# EAGLE design S3A6_Output_Signal;s_v1p00 (EAGLE 9.6.2)
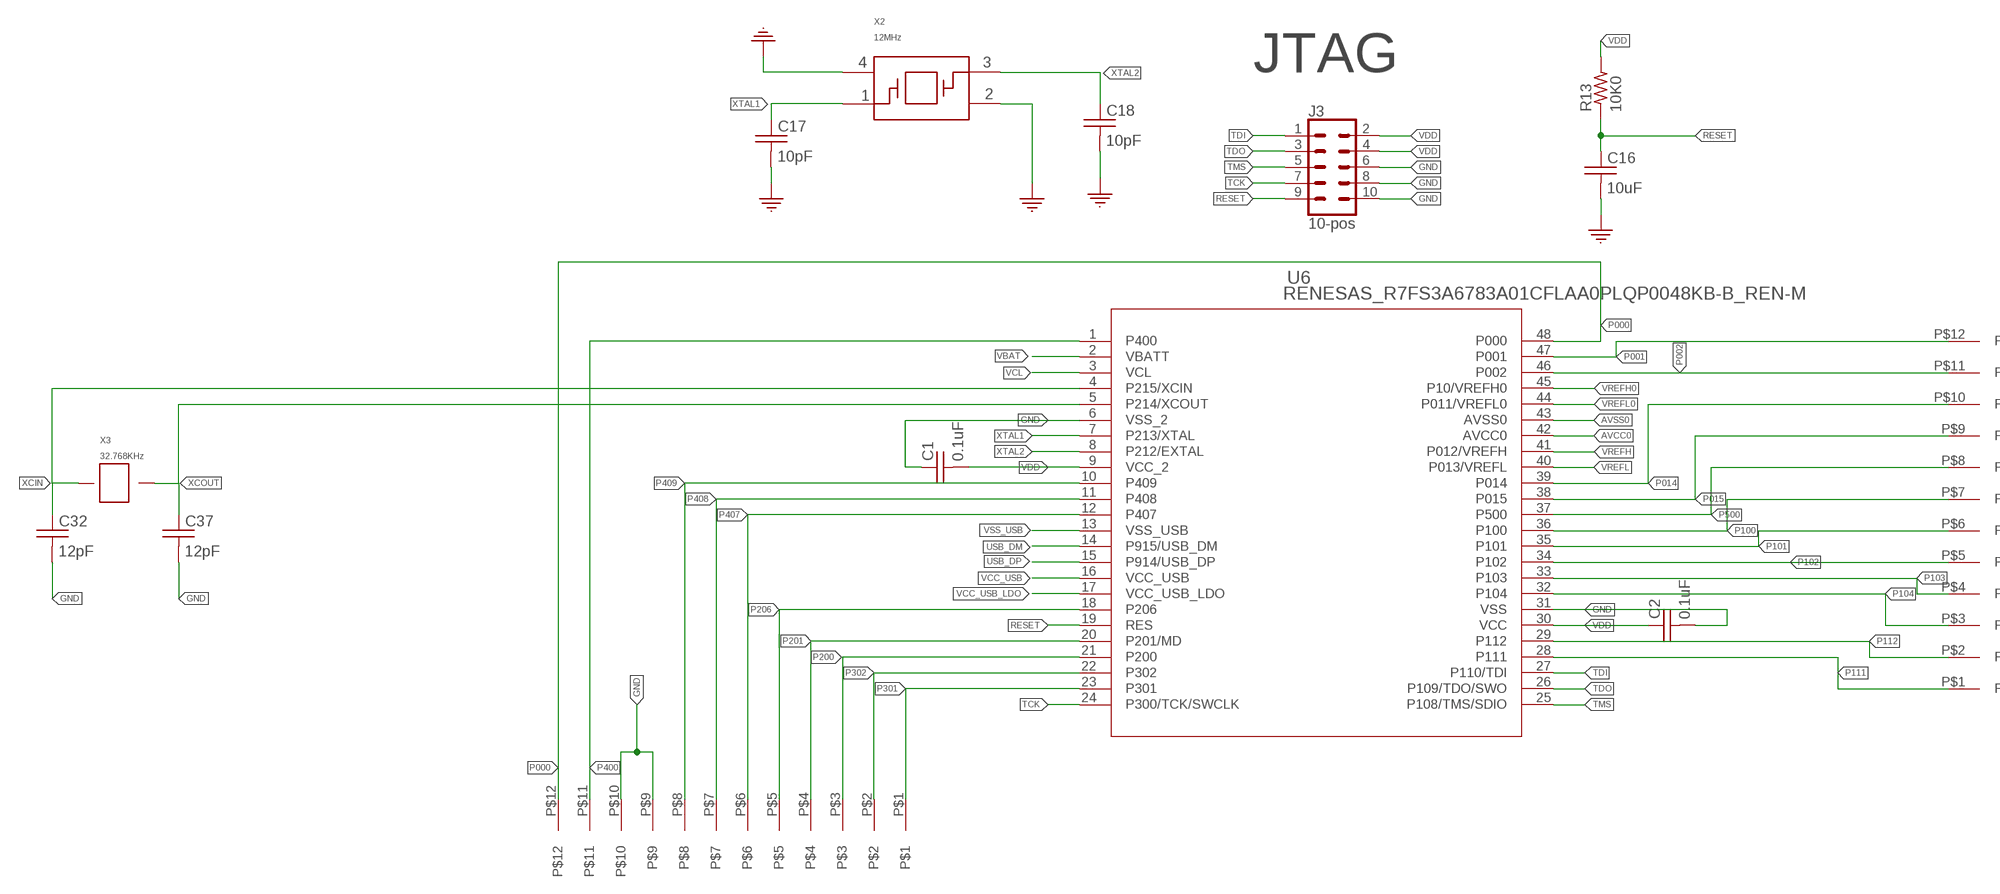
[diagram p0: schematic, sheet 1, part 1 of 2]
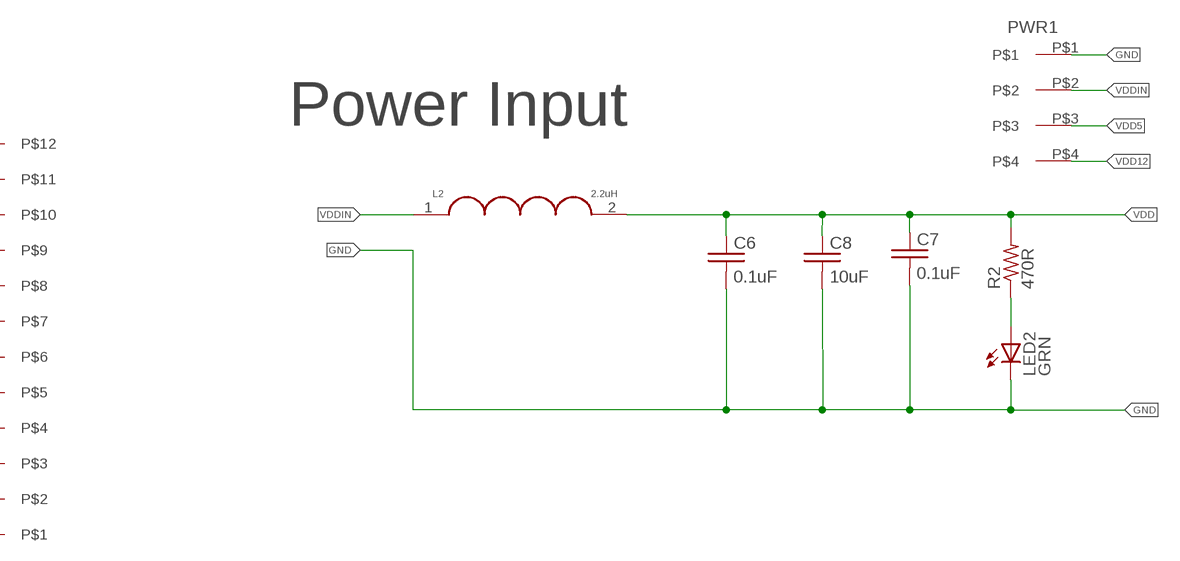
[diagram p1: schematic, sheet 1, part 2 of 2]

## Parts
C1  0.1uF  C_0402_0.1UF  [0402]
C2  0.1uF  C_0402_0.1UF  [0402]
C6  0.1uF  C_0402  [0402]
C7  0.1uF  C_0402  [0402]
C8  10uF  C_0402  [0402]
C16  10uF  C_0402_10UF  [0402]
C17  10pF  C_0402_18PF  [0402]
C18  10pF  C_0402_18PF  [0402]
C32  12pF  C_0402_12PF  [0402]
C37  12pF  C_0402_12PF  [0402]
J3  10-pos  CONN_05X2_RAPTH  [2X5]
L2  2.2uH  INDUCTOR_1008_2.2_MH_1.3A  [1008_(2520_METRIC)]
LED2  LED_0805_GREEN  [LED_0805_GREEN]
PWR1  4-pos  3.81MM_1_X_4_RT_ANGLE_PLUG_HEADER  [1X4_3.81MM_PITCH]
R2  470R  R_0402  [0402]
R13  10K0  R_0402_10K0  [0402]
U6  RENESAS_R7FS3A6783A01CFLAA0PLQP0048KB-B_REN-M  [PLQP0048KB-B_REN-M]
U$1  1_X_12_HEADER_GENERIC_.1INCH  [HEADER_1_X_12_.1_INCH]
U$2  1_X_12_HEADER_GENERIC_.1INCH  [HEADER_1_X_12_.1_INCH]
X2  12MHz  XTAL_24_MHZ  [SMD_3225]
X3  32.768KHz  XTAL_32.768KHZ  [SMD_X_2_PADS]

## Nets
AVCC0: U6.42(AVCC0)
AVSS0: U6.43(AVSS0)
GND: C1.P$1 C2.P$2 C6.P$2 C7.P$2 C8.P$2 C16.P$2 C17.P$2 C18.P$2 C32.P$2 C37.P$2 J3.6 J3.8 J3.10 LED2.C PWR1.P$1 U6.6(VSS_2) U6.31(VSS) U$1.P$9 U$1.P$10 X2.2 X2.4
N$2: LED2.A R2.P$1
P000: U6.48(P000) U$1.P$12
P001: U6.47(P001) U$2.P$12
P002: U6.46(P002) U$2.P$11
P014: U6.39(P014) U$2.P$10
P015: U6.38(P015) U$2.P$9
P100: U6.36(P100) U$2.P$7
P101: U6.35(P101) U$2.P$6
P102: U6.34(P102) U$2.P$5
P103: U6.33(P103) U$2.P$4
P104: U6.32(P104) U$2.P$3
P111: U6.28(P111) U$2.P$1
P112: U6.29(P112) U$2.P$2
P200: U6.21(P200) U$1.P$3
P201: U6.20(P201/MD) U$1.P$4
P206: U6.18(P206) U$1.P$5
P301: U6.23(P301) U$1.P$1
P302: U6.22(P302) U$1.P$2
P400: U6.1(P400) U$1.P$11
P407: U6.12(P407) U$1.P$6
P408: U6.11(P408) U$1.P$7
P409: U6.10(P409) U$1.P$8
P500: U6.37(P500) U$2.P$8
RESET: C16.P$1 J3.9 R13.P$1 U6.19(RES)
TCK: J3.7 U6.24(P300/TCK/SWCLK)
TDI: J3.1 U6.27(P110/TDI)
TDO: J3.3 U6.26(P109/TDO/SWO)
TMS: J3.5 U6.25(P108/TMS/SDIO)
USB_DM: U6.14(P915/USB_DM)
USB_DP: U6.15(P914/USB_DP)
VBAT: U6.2(VBATT)
VCC_USB: U6.16(VCC_USB)
VCC_USB_LDO: U6.17(VCC_USB_LDO)
VCL: U6.3(VCL)
VDD: C1.P$2 C2.P$1 C6.P$1 C7.P$1 C8.P$1 J3.2 J3.4 L2.2 R2.P$2 R13.P$2 U6.9(VCC_2) U6.30(VCC)
VDD5: PWR1.P$3
VDD12: PWR1.P$4
VDDIN: L2.1 PWR1.P$2
VREFH: U6.41(P012/VREFH)
VREFH0: U6.45(P10/VREFH0)
VREFL: U6.40(P013/VREFL)
VREFL0: U6.44(P011/VREFL0)
VSS_USB: U6.13(VSS_USB)
XCIN: C32.P$1 U6.4(P215/XCIN) X3.P$1
XCOUT: C37.P$1 U6.5(P214/XCOUT) X3.P$2
XTAL1: C17.P$1 U6.7(P213/XTAL) X2.1
XTAL2: C18.P$1 U6.8(P212/EXTAL) X2.3

## Notes on the sheet
- JTAG
- Power Input

## Library data of the parts
C1 C2 = 3D_MIG_Controller:C_0402_0.1UF; PARTNO: CL05F104ZO5NNNC
C6-C8 = 3D_MIG_Controller:C_0402
C16 = 3D_MIG_Controller:C_0402_10UF; PARTNO: CL05A106MP8NUB8
C17 C18 = 3D_MIG_Controller:C_0402_18PF; PARTNO: UMK105CG180JV-F; VALUE: 18pF
C32 C37 = 3D_MIG_Controller:C_0402_12PF; PARTNO: CL05C120JB5NNNC
J3 = 3D_MIG_Controller:CONN_05X2_RA: Connector Header Through Hole, Right Angle 10 position 0.100" (2.54mm); PARTNO: PH2RA-10-UA
L2 = 3D_MIG_Controller:INDUCTOR_1008_2.2_MH_1.3A
LED2 = 3D_MIG_Controller:LED_0805_GREEN
PWR1 = 3D_MIG_Controller:3.81MM_1_X_4_RT_ANGLE_PLUG_HEADER: 4 Position Terminal Block Header, Male Pins, Shrouded (4 Side) 0.150" (3.81mm) 90°, Right Angle - Through Hole; PARTNO: 691322310004
R2 = 3D_MIG_Controller:R_0402
R13 = 3D_MIG_Controller:R_0402_10K0; PARTNO: RMCF0402JT10K0
U6 = 3D_MIG_Controller:RENESAS_R7FS3A6783A01CFLAA0; BUILT_BY: EMA_Cory; COPYRIGHT: Copyright (C) 2021 Accelerated Designs. All rights reserved; DATASHEET: https://www.renesas.com/us/en/document/dst/s3a6-microcontroller-group-datasheet-r01ds0308eu0120?language=en; MANUFACTURER_PART_NUMBER: R7FS3A6783A01CFL#AA0; SOURCELIBRARY: Add_to_database_2021-06-10; VENDOR: Renesas Electronics
U$1 U$2 = 3D_MIG_Controller:1_X_12_HEADER_GENERIC_.1INCH
X2 = 3D_MIG_Controller:XTAL_24_MHZ; PARTNO: FA-238 24.0000MB-C3; VALUE: 24MHz
X3 = 3D_MIG_Controller:XTAL_32.768KHZ; PARTNO: ABS07-32.768KHZ-T

## Board
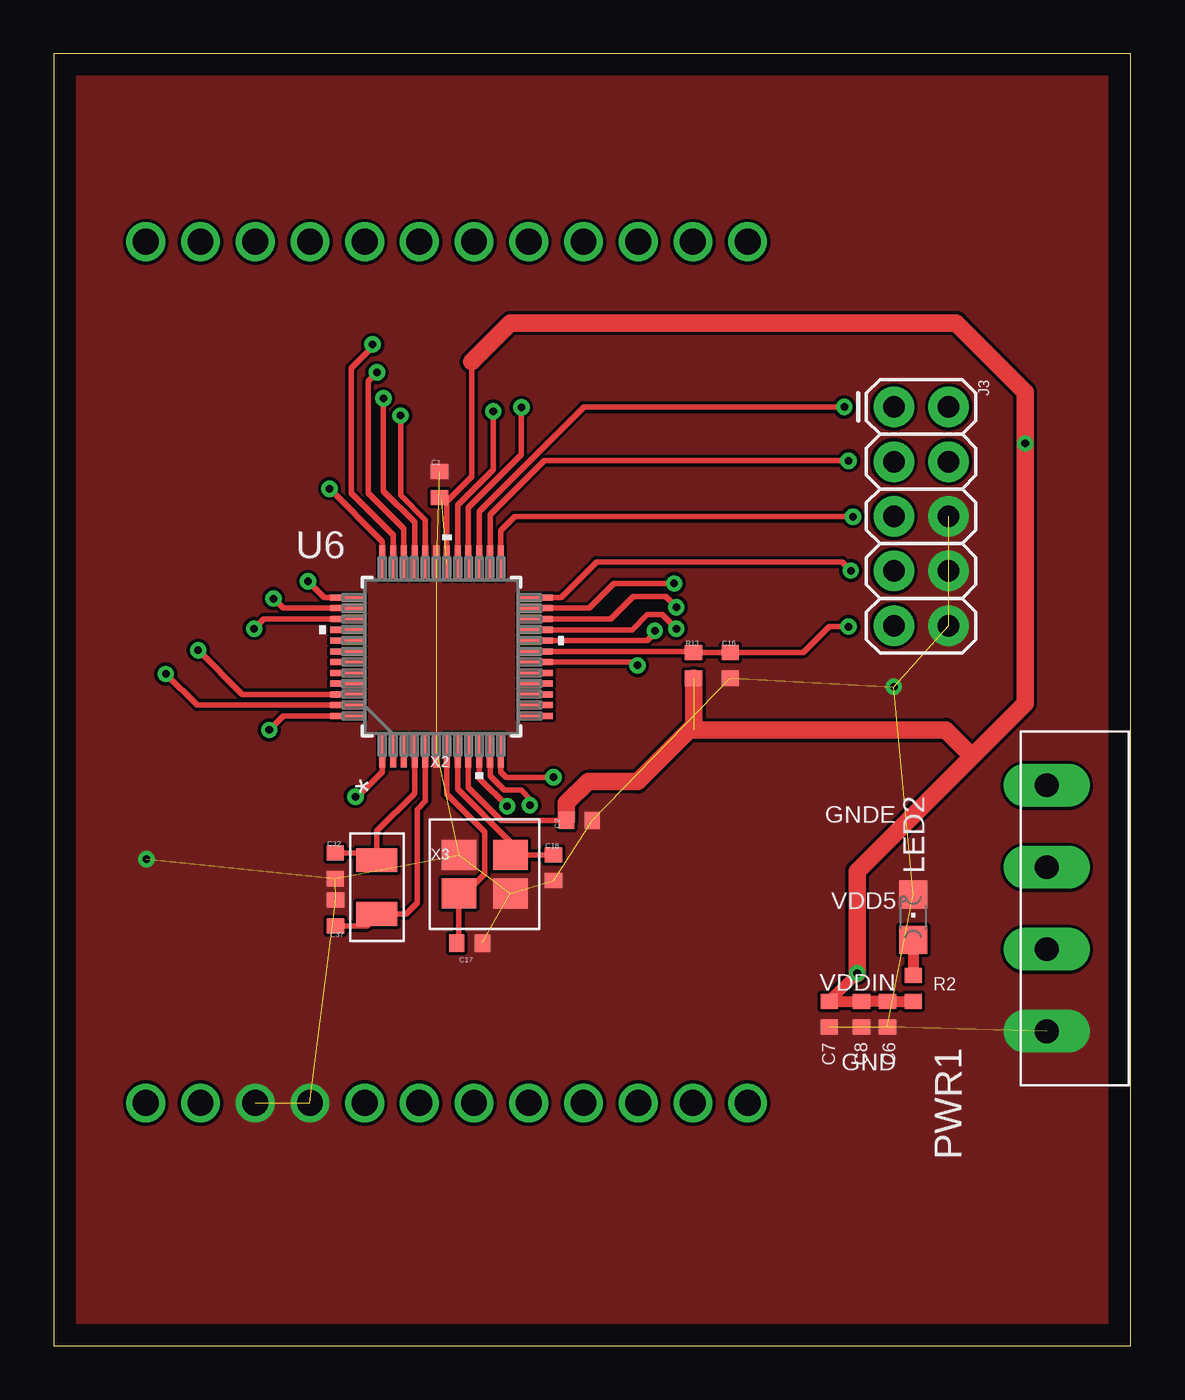
[diagram p2: board, top side]
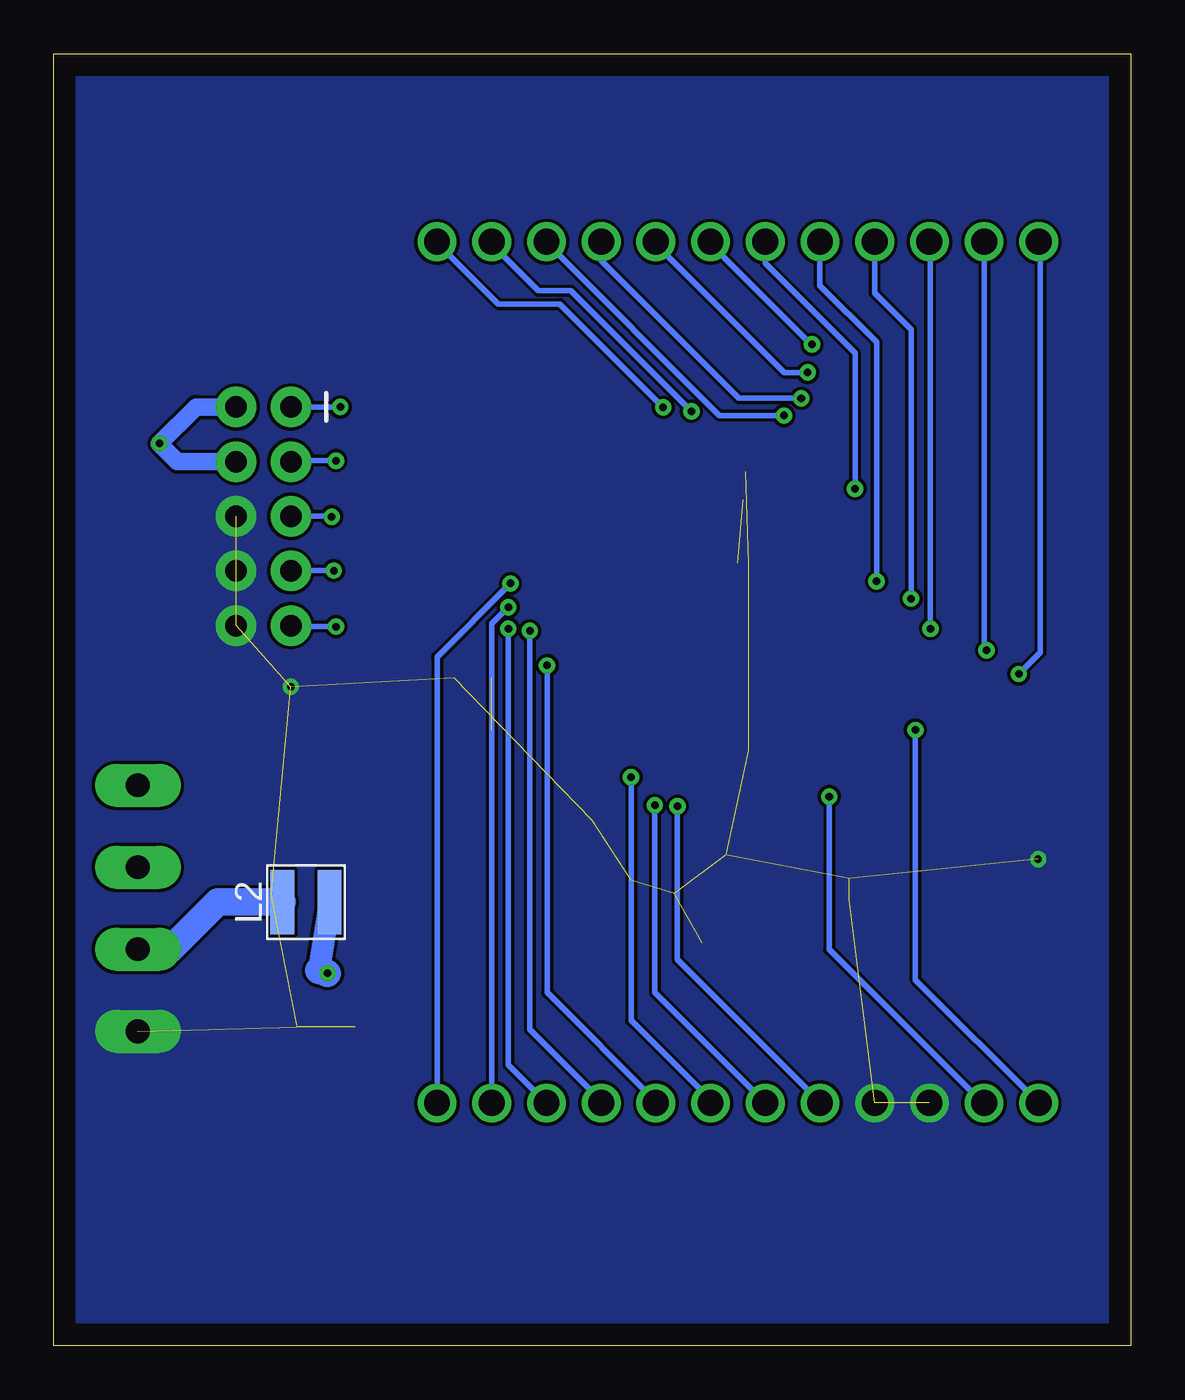
[diagram p3: board, bottom side, seen from below]

Size 50 x 60 mm. Coordinates in mm from the lower left corner, seen from the top.
Outline: 0,0 50,0 50,60 0,60 0,0
Copper layers (1*16): Top 0.035mm / dielectric 1.5mm / Bottom 0.035mm
Design rules "default": minimum track width 6mil, minimum drill 0.35mm, track to track 6mil, track to pad 6mil, pad to pad 6mil, via to via 6mil, smd to smd 6mil, copper to edge 40mil, drill to drill 6mil, minimum pad ring 10mil, minimum via ring 8mil, stop-mask expansion 4mil, vias tented up to drill 0mil, thermal gap 10mil

### Footprints (pad centres in the part's own frame; a part is rotated, then mirrored left to right if it is on the bottom)
0402 = smd 0.8 x 0.7: P$1 0,0.6; P$2 0,-0.6
2X5 = drill 1 pad 1.88: 1 0,0; 2 0,2.54; 3 2.54,0; 4 2.54,2.54; 5 5.08,0; 6 5.08,2.54; 7 7.62,0; 8 7.62,2.54; 9 10.16,0; 10 10.16,2.54
1008_(2520_METRIC) = smd 3 x 1.1: 1 0,1.1; 2 0,-1.1
LED_0805_GREEN = smd 1.3 x 1.3: A 0,-1.05; C 0,1.05
1X4_3.81MM_PITCH = drill 1.1 pad 2 long: P$1 0,0; P$2 3.81,0; P$3 7.62,0; P$4 11.43,0
PLQP0048KB-B_REN-M = smd 1.6 x 0.279: 1 -4.356,2.75; 2 -4.356,2.25; 3 -4.356,1.75; 4 -4.356,1.25; 5 -4.356,0.75; 6 -4.356,0.25; 7 -4.356,-0.25; 8 -4.356,-0.75; 9 -4.356,-1.25; 10 -4.356,-1.75; 11 -4.356,-2.25; 12 -4.356,-2.75; 25 4.356,-2.75; 26 4.356,-2.25; 27 4.356,-1.75; 28 4.356,-1.25; 29 4.356,-0.75; 30 4.356,-0.25; 31 4.356,0.25; 32 4.356,0.75; 33 4.356,1.25; 34 4.356,1.75; 35 4.356,2.25; 36 4.356,2.75 | smd 0.279 x 1.6: 13 -2.75,-4.356; 14 -2.25,-4.356; 15 -1.75,-4.356; 16 -1.25,-4.356; 17 -0.75,-4.356; 18 -0.25,-4.356; 19 0.25,-4.356; 20 0.75,-4.356; 21 1.25,-4.356; 22 1.75,-4.356; 23 2.25,-4.356; 24 2.75,-4.356; 37 2.75,4.356; 38 2.25,4.356; 39 1.75,4.356; 40 1.25,4.356; 41 0.75,4.356; 42 0.25,4.356; 43 -0.25,4.356; 44 -0.75,4.356; 45 -1.25,4.356; 46 -1.75,4.356; 47 -2.25,4.356; 48 -2.75,4.356
HEADER_1_X_12_.1_INCH = drill 1.2 pad 1.6: P$1 -29.21,-1.27; P$2 -26.67,-1.27; P$3 -24.13,-1.27; P$4 -21.59,-1.27; P$5 -19.05,-1.27; P$6 -16.51,-1.27; P$7 -13.97,-1.27; P$8 -11.43,-1.27; P$9 -8.89,-1.27; P$10 -6.35,-1.27; P$11 -3.81,-1.27; P$12 -1.27,-1.27
SMD_3225 = smd 1.6 x 1.4: 1 -1.2,-0.9; 2 1.2,-0.9; 3 1.2,0.9; 4 -1.2,0.9
SMD_X_2_PADS = smd 1.9 x 1.1: P$1 0,1.25; P$2 0,-1.25

### Placement (x,y rotation side)
C1  17.9,40 0 top
C2  24.4,24.4 90 top
C6  38.7,15.4 0 top
C7  36,15.4 0 top
C8  37.5,15.4 0 top
C16  31.4,31.6 0 top
C17  19.3,18.7 90 top
C18  23.2,22.2 0 top
C32  13.07,22.29 0 top
C37  13.08,20.1 180 top
J3  39,43.6 270 top
L2  38.3,20.6 90 bottom
LED2  39.9,19.9 0 top
PWR1  46.1,14.6 90 top
R2  39.9,16.6 0 top
R13  29.7,31.6 0 top
U6  18,32 90 top
U$1  3,10 180 top
U$2  3,50 180 top
X2  20,21.9 0 top
X3  15,21.3 0 top

### Tracks (layer width: path | path; a pad name or v marks a point on that pad's centre or on a via)
GND  (via drill 0.35)  (22 unrouted)
  other vias: 4.3,22.6 39,30.6
  pour Top (no thermals): 0,60 50,60 50,0 0,0
  pour Bottom (no thermals): 0,60 50,60 50,0 0,0
N$2
  Top 0.508: LED2.A R2.P$1
P000  (via drill 0.35)
  Top 0.254: U6.48 10.65,29.25 v10,28.6
  Bottom 0.254: v10,28.6 10,17 U$1.P$12
P001  (via drill 0.35)
  Top 0.254: U6.47 6.65,29.75 v5.2,31.2
  Bottom 0.254: U$2.P$12 4.2,51.2 4.2,32.2 v5.2,31.2
P002  (via drill 0.35)
  Top 0.254: U6.46 8.75,30.25 v6.7,32.3
  Bottom 0.254: v6.7,32.3 6.81,32.41 U$2.P$11
P014  (via drill 0.35)
  Top 0.254: U6.39 9.75,33.75 v9.3,33.3
  Bottom 0.254: v9.3,33.3 9.3,51.22 U$2.P$10
P015  (via drill 0.35)
  Top 0.254: U6.38 10.65,34.25 v10.2,34.7
  Bottom 0.254: v10.2,34.7 10.2,47.2 11.89,48.89 U$2.P$9
P100  (via drill 0.35)
  Top 0.254: U6.36 15.25,37.35 v12.8,39.8
  Bottom 0.254: v12.8,39.8 12.8,46.1 16.97,50.27 U$2.P$7
P101  (via drill 0.35)
  Top 0.254: U6.35 15.75,37.65 13.8,39.6 13.8,45.4 14.8,46.4 v14.8,46.5
  Bottom 0.254: U$2.P$6 19.51,51.17 14.84,46.5 v14.8,46.5
P102  (via drill 0.35)
  Top 0.254: U6.34 16.25,37.95 14.6,39.6 14.6,44.8 v15,45.2
  Bottom 0.254: v15,45.2 16.1,45.2 22.11,51.21 U$2.P$5
P103  (via drill 0.35)
  Top 0.254: U6.33 16.75,38.25 15.3,39.7 v15.3,44
  Bottom 0.254: U$2.P$4 24.59,50.39 18.2,44 v15.3,44
P104  (via drill 0.35)
  Top 0.254: U6.32 17.25,38.35 16.1,39.5 v16.1,43.2
  Bottom 0.254: v16.1,43.2 19.1,43.2 27.15,51.25 U$2.P$3
P111  (via drill 0.35)
  Top 0.254: U6.28 19.25,38.92 21.71,41.38 v21.71,43.58
  Bottom 0.254: v21.71,43.58 26.51,48.38 29.38,48.38 32.21,51.21 U$2.P$1
P112  (via drill 0.35)
  Top 0.254: U6.29 18.75,39.05 20.4,40.7 v20.4,43.4
  Bottom 0.254: U$2.P$2 29.67,51.17 27.5,49 26,49 v20.4,43.4
P200  (via drill 0.35)
  Top 0.254: v28.9,33.3 28.25,33.95 27.56,33.95 26.86,33.25 U6.21
  Bottom 0.254: v28.9,33.3 28.9,13.04 U$1.P$3
P201  (via drill 0.35)
  Top 0.254: U6.20 27.55,32.75 27.9,33.1 v27.9,33.2
  Bottom 0.254: v27.9,33.2 27.9,14.68 24.59,11.37 U$1.P$4
P206  (via drill 0.35)
  Top 0.254: U6.18 26.94,31.75 v27.1,31.59
  Bottom 0.254: v27.1,31.59 27.1,16.4 22.05,11.35 U$1.P$5
P301  (via drill 0.35)
  Top 0.254: U6.23 24.85,34.25 26,35.4 v28.8,35.4
  Bottom 0.254: v28.8,35.4 32.21,31.99 U$1.P$1
P302  (via drill 0.35)
  Top 0.254: U6.22 25.85,33.75 26.9,34.8 28.4,34.8 v28.9,34.3
  Bottom 0.254: v28.9,34.3 29.67,33.53 U$1.P$2
P400  (via drill 0.35)
  Top 0.254: U6.1 15.25,26.65 14.1,25.5 v14,25.5
  Bottom 0.254: v14,25.5 14,18.4 6.87,11.27 U$1.P$11
P407  (via drill 0.35)
  Top 0.254: U6.12 20.75,26.65 21,26.4 v23.2,26.4
  Bottom 0.254: v23.2,26.4 23.2,15.1 19.51,11.41 U$1.P$6
P408  (via drill 0.35)
  Top 0.254: U6.11 20.25,26.45 20.9,25.8 21.7,25.8 22.1,25.4 v22.1,25.1
  Bottom 0.254: v22.1,25.1 22.1,16.4 U$1.P$7
P409  (via drill 0.35)
  Top 0.254: U6.10 19.75,26.36 v21.05,25.06
  Bottom 0.254: U$1.P$8 14.43,11.33 21.05,17.95 v21.05,25.06
P500  (via drill 0.35)
  Top 0.254: U6.37 12.55,34.75 v11.8,35.5
  Bottom 0.254: v11.8,35.5 11.8,46.6 14.43,49.23 U$2.P$8
RESET  (via drill 0.35)
  Top 0.254: U6.19 29.65,32.25 R13.P$1 C16.P$1 34.8,32.2 36,33.4 v36.9,33.4
  Bottom 0.254: v36.9,33.4 38.96,33.4 J3.9
TCK  (via drill 0.35)
  Top 0.254: U6.24 23.55,34.75 25.2,36.4 36.6,36.4 v37,36
  Bottom 0.254: v37,36 38.98,36 J3.7
TDI  (via drill 0.35)
  Top 0.254: U6.27 19.75,38.75 24.6,43.6 v36.7,43.6
  Bottom 0.254: v36.7,43.6 J3.1
TDO  (via drill 0.35)
  Top 0.254: U6.26 20.25,38.59 22.76,41.1 v36.9,41.1
  Bottom 0.254: v36.9,41.1 38.96,41.1 J3.3
TMS  (via drill 0.35)
  Top 0.254: U6.25 20.75,37.86 21.39,38.5 v37.1,38.5
  Bottom 0.254: v37.1,38.5 37.12,38.52 J3.5
VDD  (via drill 0.35)  (2 unrouted)
  Top 0.254: U6.9 19.25,25.93 20.77,24.4 C2.P$1 | U6.30 18.25,39.05 18.17,39.13 19.4,40.35 19.4,45.7 | 18,39.3 C1.P$2
  Top 0.508: v37.3,17.3 36.1,16.1 C7.P$1 C8.P$1 38.6,16 C6.P$1 R2.P$2
  Top 0.813: C2.P$1 23.8,25.2 24.8,26.2 27.1,26.2 29.7,28.8 R13.P$2 | v37.3,17.3 37.3,22.03 42.63,27.37 | 42.63,27.37 45.1,29.83 v45.1,41.9 45.1,44.3 41.9,47.5 21.2,47.5 19.4,45.7 | 29.7,28.6 41.4,28.6 42.63,27.37
  Bottom 0.813: J3.4 44.26,41.06 v45.1,41.9 43.4,43.6 J3.2
  Bottom 1.016: L2.2 37.7,17.43
  Bottom 1.27: v37.3,17.3 37.7,17.43
VDDIN
  Bottom 1.27: PWR1.P$2 44.59,18.41 42.4,20.6 L2.1
XCIN
  Top 0.254: U6.4 16.75,25.65 15,23.9 15,22.7 | 15,22.7 X3.P$1 | C32.P$1 14.81,22.89 15,22.7
XCOUT
  Top 0.254: U6.5 17.25,25.3 16.87,24.92 16.87,20.57 16.35,20.05 15.1,20.05 | 15.1,20.05 X3.P$2 | C37.P$1 14.55,19.5 15.1,20.05
XTAL1
  Top 0.254: U6.7 18.23,27.62 18.23,25.63 20,23.86 20,21.9 19.1,21 X2.1 18.8,18.8 C17.P$1
XTAL2
  Top 0.254: U6.8 18.75,25.85 21.2,23.4 X2.3 C18.P$1

### Text on the board
tNames: GNDE | VDD5 | VDDIN | GND